# Altium schematic sheet Power.SchDoc
size A3; SheetNumber: 3; SheetTotal: 23
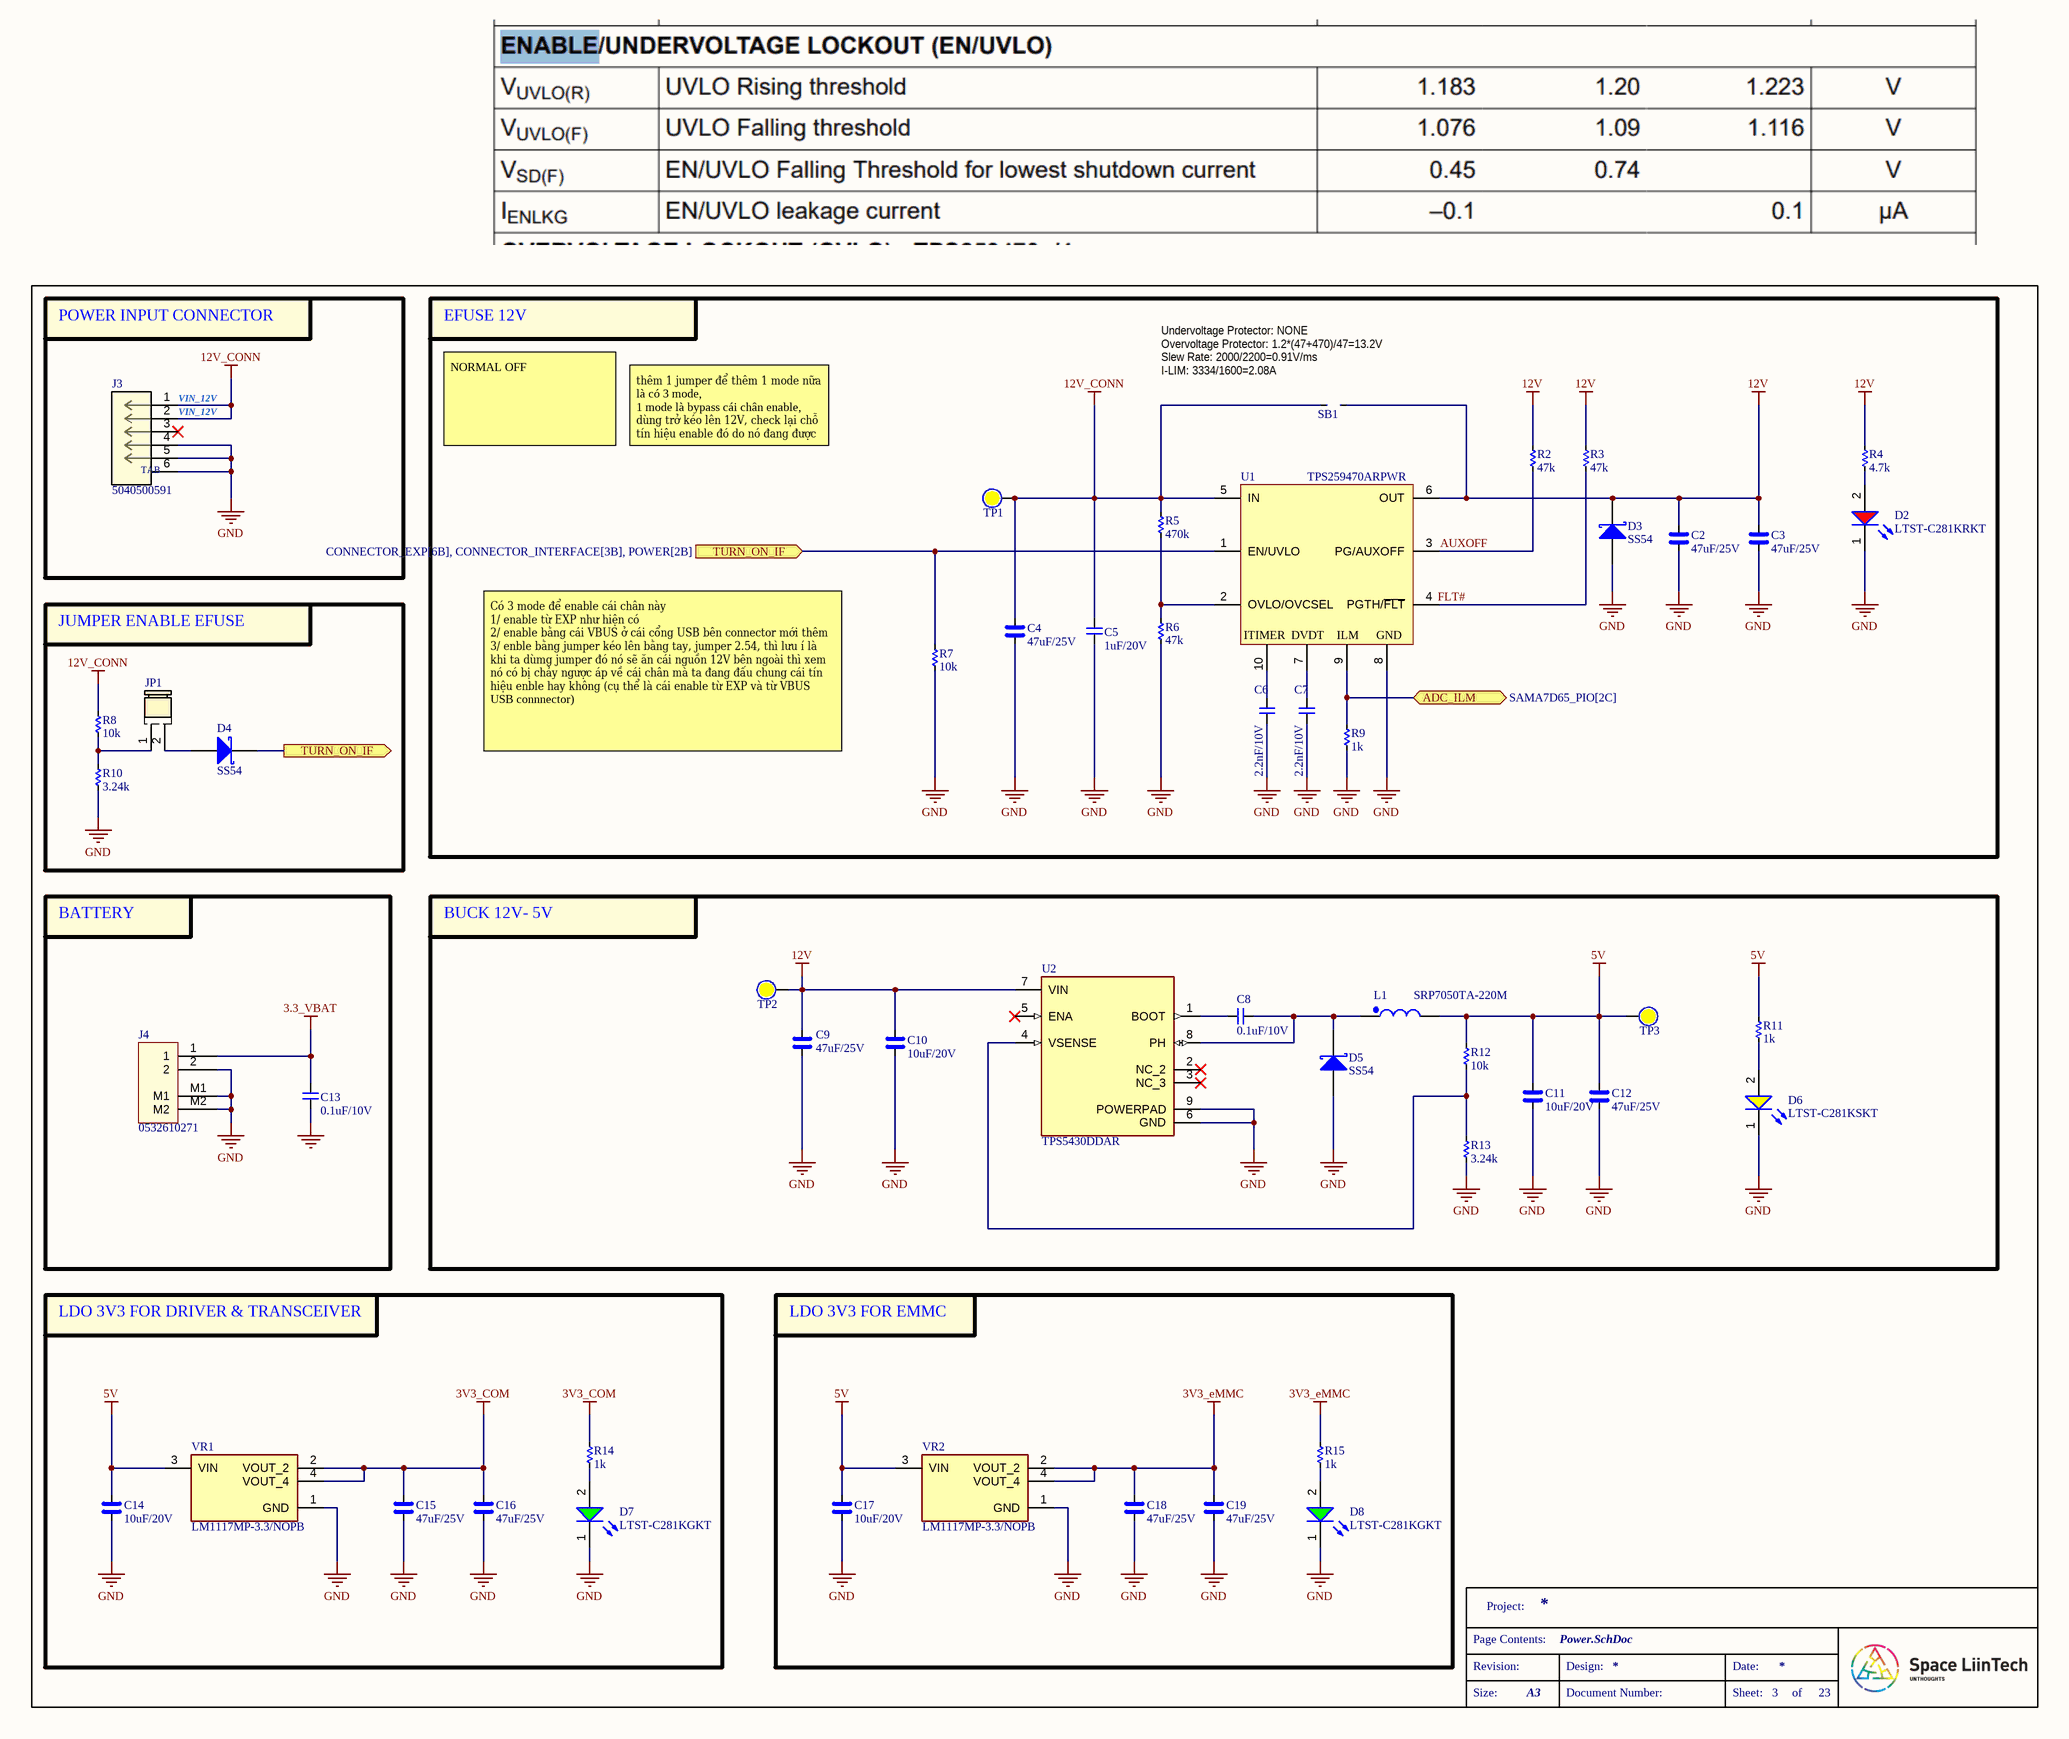
[diagram p0: Power.SchDoc]

## Parts
C2  47uF/25V  [CAP_C_3225X80]
C3  47uF/25V  [CAP_C_3225X80]
C4  47uF/25V  [CAP_C_3225X80]
C5  1uF/20V  [CAP_C_1005X50_L]
C6  2.2nF/10V  [CAP_C_1005X50_L]
C7  2.2nF/10V  [CAP_C_1005X50_L]
C8  0.1uF/10V  [CAP_C_1005X50_L]
C9  47uF/25V  [CAP_C_3225X80]
C10  10uF/20V  [CAP_C_2012X110]
C11  10uF/20V  [CAP_C_2012X110]
C12  47uF/25V  [CAP_C_3225X80]
C13  0.1uF/10V  [CAP_C_1005X50_L]
C14  10uF/20V  [CAP_C_2012X110]
C15  47uF/25V  [CAP_C_3225X80]
C16  47uF/25V  [CAP_C_3225X80]
C17  10uF/20V  [CAP_C_2012X110]
C18  47uF/25V  [CAP_C_3225X80]
C19  47uF/25V  [CAP_C_3225X80]
D2  LTST-C281KRKT  [LED_0402]
D3  SS54  [DO-214AC_SMA]
D4  SS54  [DO-214AC_SMA]
D5  SS54  [DO-214AC_SMA]
D6  LTST-C281KSKT  [LED_0402]
D7  LTST-C281KGKT  [LED_0402]
D8  LTST-C281KGKT  [LED_0402]
J3  5040500591  [5040500591]
J4  0532610271  [MOLEX_0532610271]
JP1  JUMPER_254P_NOPLACE  [JUMPER_254P_2X1_NOPLACE]  (value not drawn)
L1  SRP7050TA-220M  [SRP7050TA-220M]
R2  47k  [RES_C_1005x30_L]
R3  47k  [RES_C_1005x30_L]
R4  4.7k  [RES_C_1005x30_L]
R5  470k  [RES_C_1005x30_L]
R6  47k  [RES_C_1005x30_L]
R7  10k  [RES_C_1005x30_L]
R8  10k  [RES_C_1005x30_L]
R9  1k  [RES_C_1005x30_L]
R10  3.24k  [RES_C_1005x30_L]
R11  1k  [RES_C_1005x30_L]
R12  10k  [RES_C_1005x30_L]
R13  3.24k  [RES_C_1005x30_L]
R14  1k  [RES_C_1005x30_L]
R15  1k  [RES_C_1005x30_L]
SB1  JUMPER  [JUMPER_1608]  (value not drawn)
TP1  (no value)  [Test point]  (no BOM)
TP2  (no value)  [Test point]  (no BOM)
TP3  (no value)  [Test point]  (no BOM)
U1  TPS259470ARPWR  [VQFN-HR-10]
U2  TPS5430DDAR  [CONV_TPS5430DDAR]
VR1  LM1117MP-3.3/NOPB  [VREG_LM1117MP-3.3/NOPB]
VR2  LM1117MP-3.3/NOPB  [VREG_LM1117MP-3.3/NOPB]

## Blocks framed on the sheet
POWER INPUT CONNECTOR: J3
EFUSE 12V: C2-C7 D2 D3 R2-R7 R9 SB1 TP1 U1
JUMPER ENABLE EFUSE: D4 JP1 R8 R10
BATTERY: C13 J4
BUCK 12V- 5V: C8-C12 D5 D6 L1 R11-R13 TP2 TP3 U2
LDO 3V3 FOR DRIVER & TRANSCEIVER: C14-C16 D7 R14 VR1
LDO 3V3 FOR EMMC: C17-C19 D8 R15 VR2

## Ports
ADC_ILM (bidir, see SAMA7D65_PIO[2C]), TURN_ON_IF (in, see CONNECTOR_EXP[6B], CONNECTOR_INTERFACE[3B], POWER[2B]), TURN_ON_IF (out, see CONNECTOR_EXP[6B], CONNECTOR_INTERFACE[3B], POWER[3A])

## Nets
3.3_VBAT: C13.1 J4.1
3V3_COM: C15.2 C16.2 R14.2 VR1.2(VOUT_2) VR1.4(VOUT_4)
3V3_eMMC: C18.2 C19.2 R15.2 VR2.2(VOUT_2) VR2.4(VOUT_4)
5V: C11.2 C12.2 C14.2 C17.2 L1.2 R11.2 R12.1 TP3.0 VR1.3(VIN) VR2.3(VIN)
12V: C2.2 C3.2 C9.2 C10.2 D3.1(K) R2.2 R3.2 R4.2 SB1.2 TP2.0 U1.6(OUT) U2.7(VIN)
12V_CONN: C4.2 C5.2 J3.1 J3.2 R5.1 R8.2 SB1.1 TP1.0 U1.5(IN)
GND: C2.1 C3.1 C4.1 C5.1 C6.1 C7.1 C9.1 C10.1 C11.1 C12.1 C13.2 C14.1 C15.1 C16.1 C17.1 C18.1 C19.1 D2.1(K) D3.2(A) D5.2(A) D6.1(K) D7.1(K) D8.1(K) J3.4 J3.5 J3.6 J4.2 J4.M1 J4.M2 R6.2 R7.2 R9.2 R10.2 R13.2 U1.8(GND) U2.6(GND) U2.9(POWERPAD) VR1.1(GND) VR2.1(GND)
ADC_ILM: R9.1 U1.9(ILM) ; port ADC_ILM
AUXOFF: R2.1 U1.3(PG/AUXOFF)
FLT#: R3.1 U1.4(PGTH/~{FLT})
TURN_ON_IF: D4.2(K) R7.1 U1.1(EN/UVLO) ; port TURN_ON_IF
NetC6_2: C6.2 U1.10(ITIMER)
NetC7_2: C7.2 U1.7(DVDT)
NetC8_1: C8.1 D5.1(K) L1.1 U2.8(PH)
NetC8_2: C8.2 U2.1(BOOT)
NetD2_2: D2.2(A) R4.1
NetD4_1: D4.1(A) JP1.2
NetD6_2: D6.2(A) R11.1
NetD7_2: D7.2(A) R14.1
NetD8_2: D8.2(A) R15.1
NetJP1_1: JP1.1 R8.1 R10.1
NetR5_2: R5.2 R6.1 U1.2(OVLO/OVCSEL)
NetR12_2: R12.2 R13.1 U2.4(VSENSE)

Not connected (* = marked no-connect by the designer): J3 3*; U2 2(NC_2)* 3(NC_3)* 5(ENA)*

## Notes on the sheet
- Undervoltage Protector: NONE
- Overvoltage Protector: 1.2*(47+470)/47=13.2V
- (near SB1) Slew Rate: 2000/2200=0.91V/ms
- (near J3) VIN_12V
- (near SB1) I-LIM: 3334/1600=2.08A
- NORMAL OFF
- thêm 1 jumper để thêm 1 mode nữa là có 3 mode,
  1 mode là bypass cái chân enable, dùng trở kéo lên 12V, check lại chỗ tín hiệu enable đó do nó đang được enable bởi EXP và cái VBUS bên connector
- Có 3 mode để enable cái chân này
  1/ enable từ EXP như hiện có
  2/ enable bằng cái VBUS ở cái cổng USB bên connector mới thêm
  3/ enble bằng jumper kéo lên bằng tay, jumper 2.54, thì lưu í là khi ta dùmg jumper đó nó sẽ ăn cái nguồn 12V bên ngoài thì xem nó có bị chảy ngược áp về cái chân mà ta đang đấu chung cái tín hiệu enble hay không (cụ thể là cái enable từ EXP và từ VBUS USB connnector)
- Project:
- Page Contents:
- Revision:
- Design:
- Date:
- Size:
- A3
- Document Number:
- Sheet:
- of
- (in symbol 5040500591) TAB

## Library data of the parts
C2-C4 C9-C12 C14-C19 = _CAP_C_High_2: CAP CHIP High Value
C5-C8 C13 = _CAP_C_2: CAP CHIP
D2 = LED_RED: LED RED CLEAR 0402 SMD
D3-D5 = SS54: DIODE SCHOTTKY 40V 5A SMA; MPN: SS34; Solder: SMT; Value: SS34; MFR: *
D6 = LED_YELLOW: LED YELLOW CLEAR 0402 SMD
D7 D8 = LED_GREEN: LED GREEN CLEAR 0402 SMD
J3 = 5040500591: 1.50mm Pitch, Pico-Lock PCB Header, Single Row, Right-Angle, Surface Mount, Gold (Au) Plating, Positive Lock, 5 Circuits, Tape and Reel; Manufacturer_Name: Molex Connector Corporation; Copyright: Copyright (C) 2025 Ultra Librarian. All rights reserved.; Manufacturer_Part_Number: 5040500591; RefDes: RefDes; Type: Type
J4 = Header 2x1_2M
L1 = _IND: FIXED IND 22UH 2.5A 170 MOHM SMD
R2-R15 = _RES_B_2: RES
TP1-TP3 = Test Point: Solder: NF
U2 = TPS5430DDAR: 5.5V to 36V Input, 3A, 500kHz Step-Down Converter; MF: Texas Instruments; Package: HSOIC-8 Texas Instruments; Check_prices: https://www.snapeda.com/parts/TPS5430DDAR/Texas+Instruments/view-part/?ref=eda; Value: *; Purchase-URL: https://pricing.snapeda.com/search/part/TPS5430DDAR/?ref=eda; Availability: In Stock; SnapEDA_Link: https://www.snapeda.com/parts/TPS5430DDAR/Texas+Instruments/view-part/?ref=snap; MP: TPS5430DDAR; Price: None
VR1 VR2 = LM1117MP-3.3/NOPB: 800-mA 15-V linear voltage regulator; MF: Texas Instruments; SnapEDA_Link: https://www.snapeda.com/parts/LM1117MP-3.3/NOPB/Texas+Instruments/view-part/?ref=snap; Package: SOT-223-4 Texas Instruments; Value: *; MP: LM1117MP-3.3/NOPB; Check_prices: https://www.snapeda.com/parts/LM1117MP-3.3/NOPB/Texas+Instruments/view-part/?ref=eda